# Altium schematic sheet SCH_MCU.SchDoc
size A3; SheetNumber: 2; SheetTotal: 3
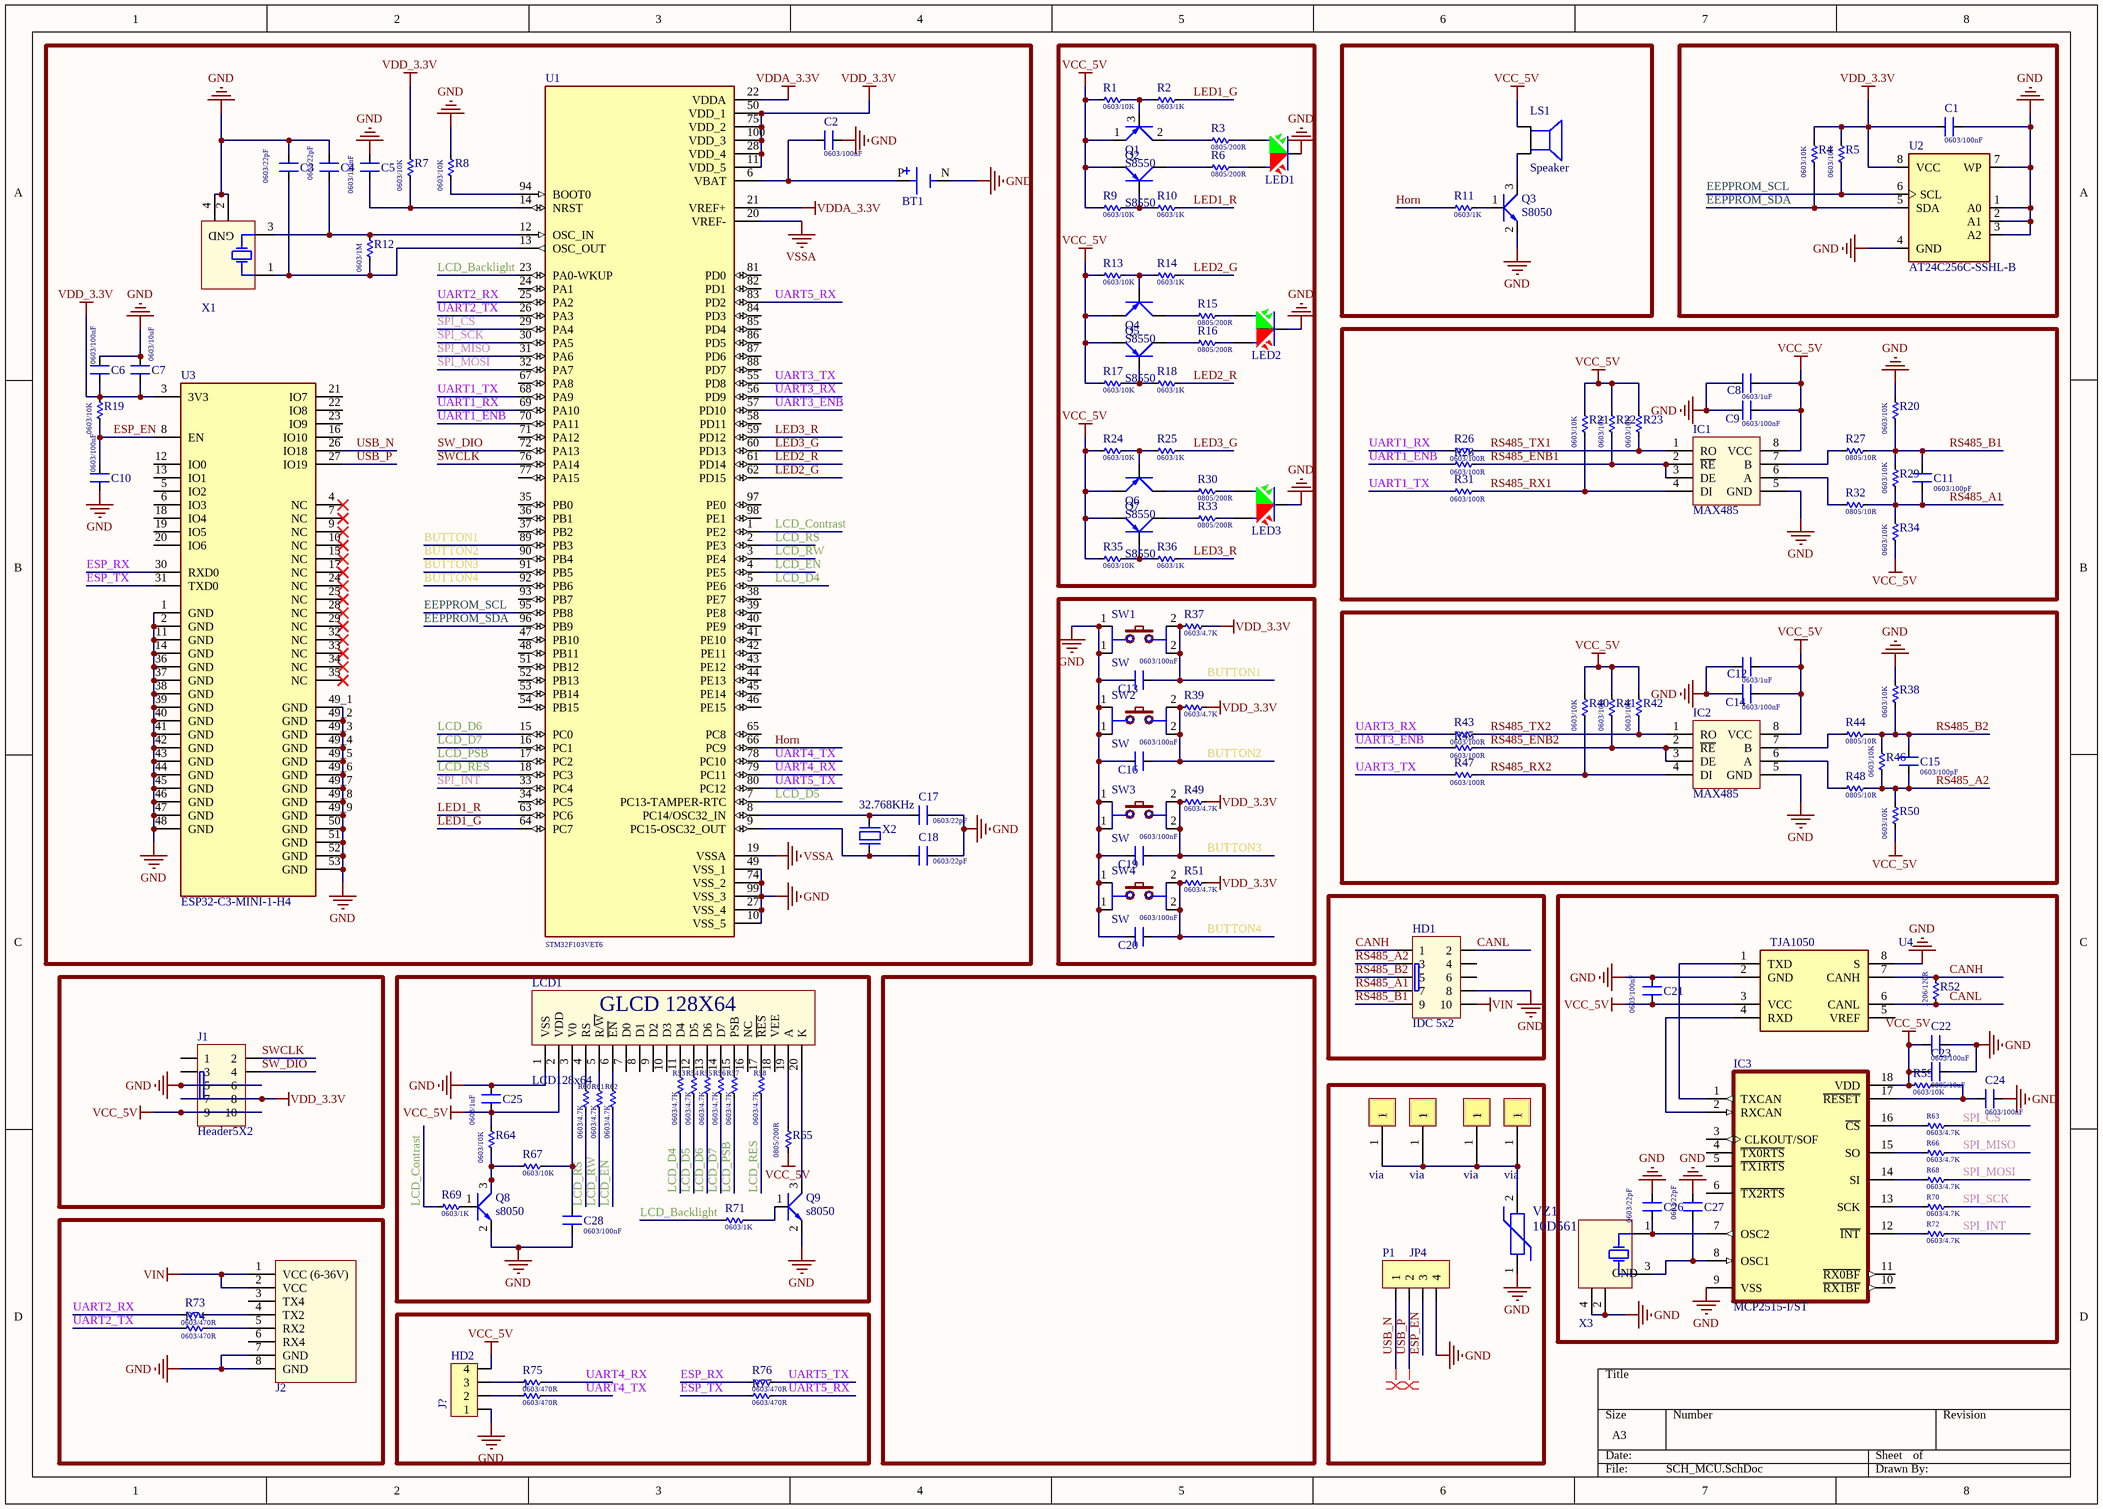
[diagram p0: SCH_MCU.SchDoc]

## Parts
1  0603/470R  [RES-SMD-0603]
BT1  BATTERY  [BAT_CR2032-BS-6-1]  (value not drawn)
C1  0603/100nF  [CAP-SMD-0603]
C2  0603/100nF  [CAP-SMD-0603]
C3  0603/22pF  [CAP-SMD-0603]
C4  0603/22pF  [CAP-SMD-0603]
C5  0603/100nF  [CAP-SMD-0603]
C6  0603/100nF  [CAP-SMD-0603]
C7  0603/10uF  [CAP-SMD-0603]
C8  0603/1uF  [CAP-SMD-0603]
C9  0603/100nF  [CAP-SMD-0603]
C10  0603/100nF  [CAP-SMD-0603]
C11  0603/100pF  [CAP-SMD-0603]
C12  0603/1uF  [CAP-SMD-0603]
C13  0603/100nF  [CAP-SMD-0603]
C14  0603/100nF  [CAP-SMD-0603]
C15  0603/100pF  [CAP-SMD-0603]
C16  0603/100nF  [CAP-SMD-0603]
C17  0603/22pF  [CAP-SMD-0603]
C18  0603/22pF  [CAP-SMD-0603]
C19  0603/100nF  [CAP-SMD-0603]
C20  0603/100nF  [CAP-SMD-0603]
C21  0603/100nF  [CAP-SMD-0603]
C22  0603/100nF  [CAP-SMD-0603]
C23  0805/10uF  [CAP-SMD-0805]
C24  0603/100nF  [CAP-SMD-0603]
C25  0603/1uF  [CAP-SMD-0603]
C26  0603/22pF  [CAP-SMD-0603]
C27  0603/22pF  [CAP-SMD-0603]
C28  0603/100nF  [CAP-SMD-0603]
HD1  IDC 5x2  [IDC10-BH]
HD2  J?  [Header4]
IC1  MAX485  [SO8]
IC2  MAX485  [SO8]
IC3  MCP2515-I/ST  [SO18]
J1  Header5X2  [IDC10-BH]
J2  8pin_2mm  [8PIN_2mm]  (value not drawn)
LCD1  LCD128x64  [LCD128X64 ST7920]
LED1  LED  [LED-32]  (value not drawn)
LED2  LED  [LED-32]  (value not drawn)
LED3  LED  [LED-32]  (value not drawn)
LS1  Speaker  [SPEAKER - 9*5.5]
P1  JP4  [JP4-C1T]
Q1  S8550  [SOT23-321]
Q2  S8550  [SOT23-321]
Q3  S8050  [SOT23-132]
Q4  S8550  [SOT23-321]
Q5  S8550  [SOT23-321]
Q6  S8550  [SOT23-321]
Q7  S8550  [SOT23-321]
Q8  s8050  [SOT23-132]
Q9  s8050  [SOT23-132]
R1  0603/10K  [RES-SMD-0603]
R2  0603/1K  [RES-SMD-0603]
R3  0805/200R  [RES-SMD-0805]
R4  0603/10K  [RES-SMD-0603]
R5  0603/10K  [RES-SMD-0603]
R6  0805/200R  [RES-SMD-0805]
R7  0603/10K  [RES-SMD-0603]
R8  0603/10K  [RES-SMD-0603]
R9  0603/10K  [RES-SMD-0603]
R10  0603/1K  [RES-SMD-0603]
R11  0603/1K  [RES-SMD-0603]
R12  0603/1M  [RES-SMD-0603]
R13  0603/10K  [RES-SMD-0603]
R14  0603/1K  [RES-SMD-0603]
R15  0805/200R  [RES-SMD-0805]
R16  0805/200R  [RES-SMD-0805]
R17  0603/10K  [RES-SMD-0603]
R18  0603/1K  [RES-SMD-0603]
R19  0603/10K  [RES-SMD-0603]
R20  0603/10K  [RES-SMD-0603]
R21  0603/10K  [RES-SMD-0603]
R22  0603/10K  [RES-SMD-0603]
R23  0603/10K  [RES-SMD-0603]
R24  0603/10K  [RES-SMD-0603]
R25  0603/1K  [RES-SMD-0603]
R26  0603/100R  [RES-SMD-0603]
R27  0805/10R  [RES-SMD-0805]
R28  0603/100R  [RES-SMD-0603]
R29  0603/10K  [RES-SMD-0603]
R30  0805/200R  [RES-SMD-0805]
R31  0603/100R  [RES-SMD-0603]
R32  0805/10R  [RES-SMD-0805]
R33  0805/200R  [RES-SMD-0805]
R34  0603/10K  [RES-SMD-0603]
R35  0603/10K  [RES-SMD-0603]
R36  0603/1K  [RES-SMD-0603]
R37  0603/4.7K  [RES-SMD-0603]
R38  0603/10K  [RES-SMD-0603]
R39  0603/4.7K  [RES-SMD-0603]
R40  0603/10K  [RES-SMD-0603]
R41  0603/10K  [RES-SMD-0603]
R42  0603/10K  [RES-SMD-0603]
R43  0603/100R  [RES-SMD-0603]
R44  0805/10R  [RES-SMD-0805]
R45  0603/100R  [RES-SMD-0603]
R46  0603/10K  [RES-SMD-0603]
R47  0603/100R  [RES-SMD-0603]
R48  0805/10R  [RES-SMD-0805]
R49  0603/4.7K  [RES-SMD-0603]
R50  0603/10K  [RES-SMD-0603]
R51  0603/4.7K  [RES-SMD-0603]
R52  1206/120R  [RES-SMD-0603]
R53  0603/4.7K  [RES-SMD-0603]
R54  0603/4.7K  [RES-SMD-0603]
R55  0603/4.7K  [RES-SMD-0603]
R56  0603/4.7K  [RES-SMD-0603]
R57  0603/4.7K  [RES-SMD-0603]
R58  0603/4.7K  [RES-SMD-0603]
R59  0603/10K  [RES-SMD-0603]
R60  0603/4.7K  [RES-SMD-0603]
R61  0603/4.7K  [RES-SMD-0603]
R62  0603/4.7K  [RES-SMD-0603]
R63  0603/4.7K  [RES-SMD-0603]
R64  0603/10K  [RES-SMD-0603]
R65  0805/200R  [RES-SMD-0805]
R66  0603/4.7K  [RES-SMD-0603]
R67  0603/10K  [RES-SMD-0603]
R68  0603/4.7K  [RES-SMD-0603]
R69  0603/1K  [RES-SMD-0603]
R70  0603/4.7K  [RES-SMD-0603]
R71  0603/1K  [RES-SMD-0603]
R72  0603/4.7K  [RES-SMD-0603]
R73  0603/470R  [RES-SMD-0603]
R74  0603/470R  [RES-SMD-0603]
R75  0603/470R  [RES-SMD-0603]
R76  0603/470R  [RES-SMD-0603]
R77  0603/470R  [RES-SMD-0603]
SW1  SW  [BUTTON-12x12]
SW2  SW  [BUTTON-12x12]
SW3  SW  [BUTTON-12x12]
SW4  SW  [BUTTON-12x12]
U1  STM32F103VET6  [QFP50P1600X1600X160-100N]
U2  AT24C256C-SSHL-B  [SO8]
U3  ESP32-C3-MINI-1-H4  [ESP32-C3-MINI-1-H4]
U4  TJA1050  [SO8]
via1  via  [VIA_LO]
via2  via  [VIA_LO]
via3  via  [VIA_LO]
via4  via  [VIA_LO]
VZ1  10D561  [Varistor 7K561 5mm]
X1  16MHz  [XT4-16.000MHz-4_V]  (value not drawn)
X2  32.768KHz  [XT2-32.768KHz-2_V]
X3  8MHz  [XT4-16.000MHz-4_V]  (value not drawn)

## Nets
GND: BT1.N(NEG) C1.1 C2.1 C3.1 C4.1 C5.2 C6.1 C7.1 C8.1 C9.1 C10.2 C12.1 C13.1 C14.1 C16.1 C17.1 C18.1 C19.1 C20.1 C21.1 C22.1 C23.1 C24.1 C25.2 C26.1 C27.1 C28.1 HD1.8 HD2.1 IC1.5(GND) IC2.5(GND) IC3.9(VSS) J1.5 J1.6 J2.7(GND) J2.8(GND) LCD1.1(VSS) LED1.2 LED2.2 LED3.2 P1.4 Q3.2(E) Q8.2(E) Q9.2(E) R8.1 R20.1 R38.1 SW1.1 SW2.1 SW3.1 SW4.1 U1.10(VSS_5) U1.27(VSS_4) U1.49(VSS_1) U1.74(VSS_2) U1.99(VSS_3) U2.1(A0) U2.2(A1) U2.3(A2) U2.4(GND) U2.7(WP) U3.1(GND) U3.2(GND) U3.11(GND) U3.14(GND) U3.36(GND) U3.37(GND) U3.38(GND) U3.39(GND) U3.40(GND) U3.41(GND) U3.42(GND) U3.43(GND) U3.44(GND) U3.45(GND) U3.46(GND) U3.47(GND) U3.48(GND) U3.49_1(GND) U3.49_2(GND) U3.49_3(GND) U3.49_4(GND) U3.49_5(GND) U3.49_6(GND) U3.49_7(GND) U3.49_8(GND) U3.49_9(GND) U3.50(GND) U3.51(GND) U3.52(GND) U3.53(GND) U4.2(GND) U4.8(S) VZ1.1 X1.2(GND) X1.4(GND) X3.2(GND) X3.4(GND)
VCC_5V: C8.2 C9.2 C12.2 C14.2 C21.2 C22.2 C23.2 C25.1 HD2.4 IC1.8(VCC) IC2.8(VCC) IC3.18(VDD) J1.9 J1.10 LCD1.2(VDD) LS1.1 Q1.1(E) Q2.1(E) Q4.1(E) Q5.1(E) Q6.1(E) Q7.1(E) R1.2 R9.2 R13.2 R17.2 R21.1 R22.1 R23.1 R24.2 R34.2 R35.2 R40.1 R41.1 R42.1 R50.2 R59.1 R64.1 R65.1 U4.3(VCC)
VDD_3.3V: C1.2 C6.2 C7.2 J1.7 J1.8 R4.1 R5.1 R7.1 R19.1 R37.2 R39.2 R49.2 R51.2 U1.11(VDD_5) U1.28(VDD_4) U1.50(VDD_1) U1.75(VDD_2) U1.100(VDD_3) U2.8(VCC) U3.3(3V3)
VDDA_3.3V: U1.21(VREF+) U1.22(VDDA)
VIN: HD1.10 J2.1(VCC_(6-36V)) J2.2(VCC)
VSSA: U1.19(VSSA) U1.20(VREF-)
BUTTON1: C13.2 R37.1 SW1.2 U1.89(PB3)
BUTTON2: C16.2 R39.1 SW2.2 U1.90(PB4)
BUTTON3: C19.2 R49.1 SW3.2 U1.91(PB5)
BUTTON4: C20.2 R51.1 SW4.2 U1.92(PB6)
CANH: HD1.1 R52.1 U4.7(CANH)
CANL: HD1.2 R52.2 U4.6(CANL)
EEPPROM_SCL: R5.2 U1.95(PB8) U2.6(SCL)
EEPPROM_SDA: R4.2 U1.96(PB9) U2.5(SDA)
ESP_EN: C10.1 P1.3 R19.2 U3.8(EN)
ESP_RX: R76.1 U3.30(RXD0)
ESP_TX: R77.1 U3.31(TXD0)
Horn: R11.1 U1.66(PC9)
LCD_Backlight: R71.1 U1.23(PA0-WKUP)
LCD_Contrast: R69.1 U1.1(PE2)
LCD_D4: R53.1 U1.5(PE6)
LCD_D5: R54.1 U1.7(PC13-TAMPER-RTC)
LCD_D6: R55.1 U1.15(PC0)
LCD_D7: R56.1 U1.16(PC1)
LCD_EN: R62.1 U1.4(PE5)
LCD_PSB: R57.1 U1.17(PC2)
LCD_RES: R58.1 U1.18(PC3)
LCD_RS: R60.1 U1.2(PE3)
LCD_RW: R61.1 U1.3(PE4)
LED1_G: R2.2 U1.64(PC7)
LED1_R: R10.2 U1.63(PC6)
LED2_G: R14.2 U1.62(PD15)
LED2_R: R18.2 U1.61(PD14)
LED3_G: R25.2 U1.60(PD13)
LED3_R: R36.2 U1.59(PD12)
RS485_A1: C11.1 HD1.7 R29.2 R32.2 R34.1
RS485_A2: C15.1 HD1.3 R46.2 R48.2 R50.1
RS485_B1: C11.2 HD1.9 R20.2 R27.2 R29.1
RS485_B2: C15.2 HD1.5 R38.2 R44.2 R46.1
RS485_ENB1: IC1.2(~{RE}) IC1.3(DE) R22.2 R28.2
RS485_ENB2: IC2.2(~{RE}) IC2.3(DE) R41.2 R45.2
RS485_RX1: IC1.4(DI) R21.2 R31.2
RS485_RX2: IC2.4(DI) R40.2 R47.2
RS485_TX1: IC1.1(RO) R23.2 R26.2
RS485_TX2: IC2.1(RO) R42.2 R43.2
SPI_CS: R63.1 U1.29(PA4)
SPI_INT: R72.1 U1.33(PC4)
SPI_MISO: R66.1 U1.31(PA6)
SPI_MOSI: R68.1 U1.32(PA7)
SPI_SCK: R70.1 U1.30(PA5)
SW_DIO: J1.4 U1.72(PA13)
SWCLK: J1.2 U1.76(PA14)
UART1_ENB: R28.1 U1.70(PA11)
UART1_RX: R26.1 U1.69(PA10)
UART1_TX: R31.1 U1.68(PA9)
UART2_RX: R73.1 U1.25(PA2)
UART2_TX: R74.1 U1.26(PA3)
UART3_ENB: R45.1 U1.57(PD10)
UART3_RX: R43.1 U1.56(PD9)
UART3_TX: R47.1 U1.55(PD8)
UART4_RX: R75.2 U1.79(PC11)
UART4_TX: 1.2 U1.78(PC10)
UART5_RX: R77.2 U1.83(PD2)
UART5_TX: R76.2 U1.80(PC12)
USB_N: P1.1 U3.26(IO18)
USB_P: P1.2 U3.27(IO19)
Net1_1: 1.1 HD2.2
NetBT1_P: BT1.P(POS) C2.2 U1.6(VBAT)
NetC3_2: C3.2 R12.2 U1.13(OSC_OUT) X1.1(XTAL)
NetC4_2: C4.2 R12.1 U1.12(OSC_IN) X1.3(XTAL)
NetC5_1: C5.1 R7.2 U1.14(NRST)
NetC17_2: C17.2 U1.8(PC14/OSC32_IN) X2.2
NetC18_2: C18.2 U1.9(PC15-OSC32_OUT) X2.1
NetC24_2: C24.2 IC3.17(~{RESET}) R59.2
NetC26_2: C26.2 IC3.7(OSC2) X3.1(XTAL)
NetC27_2: C27.2 IC3.8(OSC1) X3.3(XTAL)
NetC28_2: C28.2 LCD1.3(V0) R67.2
NetHD2_3: HD2.3 R75.1
NetIC1_6: IC1.6(A) R32.1
NetIC1_7: IC1.7(B) R27.1
NetIC2_6: IC2.6(A) R48.1
NetIC2_7: IC2.7(B) R44.1
NetIC3_1: IC3.1(TXCAN) U4.1(TXD)
NetIC3_2: IC3.2(RXCAN) U4.4(RXD)
NetIC3_12: IC3.12(~{INT}) R72.2
NetIC3_13: IC3.13(SCK) R70.2
NetIC3_14: IC3.14(SI) R68.2
NetIC3_15: IC3.15(SO) R66.2
NetIC3_16: IC3.16(~{CS}) R63.2
NetJ2_4: J2.4(TX2) R73.2
NetJ2_5: J2.5(RX2) R74.2
NetLCD1_4: LCD1.4(RS) R60.2
NetLCD1_5: LCD1.5(R/~{W}) R61.2
NetLCD1_6: LCD1.6(~{EN}) R62.2
NetLCD1_11: LCD1.11(D4) R53.2
NetLCD1_12: LCD1.12(D5) R54.2
NetLCD1_13: LCD1.13(D6) R55.2
NetLCD1_14: LCD1.14(D7) R56.2
NetLCD1_15: LCD1.15(PSB) R57.2
NetLCD1_17: LCD1.17(~{RES}) R58.2
NetLCD1_19: LCD1.19(A) R65.2
NetLCD1_20: LCD1.20(K) Q9.3(C)
NetLED1_1: LED1.1 R6.2
NetLED1_3: LED1.3 R3.2
NetLED2_1: LED2.1 R16.2
NetLED2_3: LED2.3 R15.2
NetLED3_1: LED3.1 R33.2
NetLED3_3: LED3.3 R30.2
NetLS1_2: LS1.2 Q3.3(C)
NetQ1_2: Q1.2(C) R3.1
NetQ1_3: Q1.3(B) R1.1 R2.1
NetQ2_2: Q2.2(C) R6.1
NetQ2_3: Q2.3(B) R9.1 R10.1
NetQ3_1: Q3.1(B) R11.2
NetQ4_2: Q4.2(C) R15.1
NetQ4_3: Q4.3(B) R13.1 R14.1
NetQ5_2: Q5.2(C) R16.1
NetQ5_3: Q5.3(B) R17.1 R18.1
NetQ6_2: Q6.2(C) R30.1
NetQ6_3: Q6.3(B) R24.1 R25.1
NetQ7_2: Q7.2(C) R33.1
NetQ7_3: Q7.3(B) R35.1 R36.1
NetQ8_1: Q8.1(B) R69.2
NetQ8_3: Q8.3(C) R64.2 R67.1
NetQ9_1: Q9.1(B) R71.2
NetR8_2: R8.2 U1.94(BOOT0)
Netvia1_1: via1.1 via2.1 via3.1 via4.1 VZ1.2

Not connected (* = marked no-connect by the designer): HD1 4 6; IC3 3(CLKOUT/SOF) 4(~{TX0RTS}) 5(~{TX1RTS}) 6(~{TX2RTS}) 10(~{RX1BF}) 11(~{RX0BF}); J1 1 3; J2 3(TX4) 6(RX4); LCD1 7(D0) 8(D1) 9(D2) 10(D3) 16(NC) 18(VEE); U1 24(PA1) 34(PC5) 35(PB0) 36(PB1) 37(PB2) 38(PE7) 39(PE8) 40(PE9) 41(PE10) 42(PE11) 43(PE12) 44(PE13) 45(PE14) 46(PE15) 47(PB10) 48(PB11) 51(PB12) 52(PB13) 53(PB14) 54(PB15) 58(PD11) 65(PC8) 67(PA8) 71(PA12) 77(PA15) 81(PD0) 82(PD1) 84(PD3) 85(PD4) 86(PD5) 87(PD6) 88(PD7) 93(PB7) 97(PE0) 98(PE1); U3 4(NC)* 5(IO2) 6(IO3) 7(NC)* 9(NC)* 10(NC)* 12(IO0) 13(IO1) 15(NC)* 16(IO10) 17(NC)* 18(IO4) 19(IO5) 20(IO6) 21(IO7) 22(IO8) 23(IO9) 24(NC)* 25(NC)* 28(NC)* 29(NC)* 32(NC)* 33(NC)* 34(NC)* 35(NC)*; U4 5(VREF)

## Layout directives
differential pair: USB_N, USB_P

## Notes on the sheet
- (in symbol LCD128x64) GLCD 128X64

## Library data of the parts
1 R1-R77 = Res-SMD: Resistor; Manufacturer: Generic Components; Class: Passive; Published: 08/06/2000; Publisher: Altium Hobart Technology Centre
BT1 = CR2032-BS-6-1: Battery base CR2032 SMD Battery Connectors ROHS; MF: Shenzhen Q&J Electronics Co. Ltd; Package: Package; Check_prices: https://www.snapeda.com/parts/CR2032-BS-6-1/Shenzhen+Q%2526J+Electronics+Co.+Ltd/view-part/?ref=eda; SnapEDA_Link: https://www.snapeda.com/parts/CR2032-BS-6-1/Shenzhen+Q%2526J+Electronics+Co.+Ltd/view-part/?ref=snap; MP: CR2032-BS-6-1; Value: *; Availability: Not in stock; Price: None
C1-C28 = CAP-SMD: Value: 33pF
HD1 = IDC 5X2: Value: Header 5x2
HD2 = Header4: Header IDC, 4 x 1 Pin Vertical 2.54mm Pitch (Non-Boxed, Male); Manufacturer: W¨¹rth Elektronik eiSos GmbH; partNo: 613002143121; ComponentLink1 Description: Manufacturer; ComponentLink2 Description: Datasheet; NoPins: 02; Created Date: 29 March 2013; ComponentLink1URL: http://www.we-online.com; ComponentLink2URL: http://katalog.we-online.de/em/datasheet/6130xx143121.pdf; Created by: Karrer Zheng
IC1 IC2 = IC MAX485: RS232 - RS485 (Same sn75176)
IC3 = MCP2515-I/ST: CAN 1Mbps Sleep/Standby 3.3V/5V 20-Pin TSSOP Tube; MF: Microchip Technology; Package: TSSOP-20 Microchip; MP: MCP2515-I/ST; Value: *; Availability: In Stock; SnapEDA_Link: https://www.snapeda.com/parts/MCP2515-I/ST/Microchip/view-part/?ref=snap; Price: None; Check_prices: https://www.snapeda.com/parts/MCP2515-I/ST/Microchip/view-part/?ref=eda
LCD1 = LCD128x64: LCD Graphic 128x64; Value: LCD 128x64
LED1-LED3 = LED2: LED 2 colour Green and Red; Value: LED 3 - 5 ly 2 Colour
LS1 = Speaker: Loudspeaker; Published: 24-Mar-1999; LatestRevisionDate: 17-Jul-2002; LatestRevisionNote: Re-released for DXP Platform.; PackageReference: PIN2; Publisher: Altium Limited
P1 = JP4: WR-PHD 2.54 mm Angled Socket Header; Manufacturer: W¨¹rth Elektronik eiSos GmbH; partNo: 613004143121; ComponentLink1 Description: Manufacturer; ComponentLink2 Description: Datasheet; NoPins: 04; Created Date: 29 March 2013; ComponentLink1URL: http://www.we-online.com; ComponentLink2URL: http://katalog.we-online.de/em/datasheet/6130xx143121.pdf; Created by: Karrer Zheng
Q1 Q2 Q4-Q7 = BJT PNP: PNP 600mW, ECB; Value: A1015
Q3 Q8 Q9 = BJT NPN: NPN 600mW, ECB; Value: C1815
SW1-SW4 = SW4: Switch button 4 pin; Value: Button chip 4 pin
U1 = STM32F103VET6: ARMÂ® CortexÂ®-M3 STM32F1 Microcontroller IC 32-Bit 72MHz 512KB (512K x 8) FLASH 100-LQFP (14x14); MF: STMicroelectronics; SnapEDA_Link: https://www.snapeda.com/parts/STM32F103VET6/STMicroelectronics/view-part/?ref=snap; Package: LQFP-100 STMicroelectronics; Value: *; MP: STM32F103VET6; Check_prices: https://www.snapeda.com/parts/STM32F103VET6/STMicroelectronics/view-part/?ref=eda
U2 = AT24C256C-SSHL-B: EEPROM Serial-2Wire 256K-bit 32K x 8 1.8V/2.5V/3.3V/5V Automotive 8-Pin SOIC N Tube; MF: Microchip Technology; Package: SO-8 Microchip; Price: None; Check_prices: https://www.snapeda.com/parts/AT24C256C-SSHL-B/Microchip/view-part/?ref=eda; Value: *; SnapEDA_Link: https://www.snapeda.com/parts/AT24C256C-SSHL-B/Microchip/view-part/?ref=snap; MP: AT24C256C-SSHL-B; Availability: In Stock; Purchase-URL: https://pricing.snapeda.com/search/part/AT24C256C-SSHL-B/?ref=eda
U3 = ESP32-C3-MINI-1-H4: Bluetooth, WiFi 802.11b/g/n, Bluetooth v5.0 Transceiver Module 2.412GHz ~ 2.484GHz PCB Trace Surface Mount; Price: None; Value: *
U4 = TJA1050: CAN 1MBd Silent 5V Automotive 8-Pin SO T/R; MF: NXP Semiconductors; SnapEDA_Link: https://www.snapeda.com/parts/TJA1050/NXP+Semiconductors/view-part/?ref=snap; Package: None; Value: *; MP: TJA1050; Check_prices: https://www.snapeda.com/parts/TJA1050/NXP+Semiconductors/view-part/?ref=eda
via1-via4 = Vit oc
VZ1 = VAR: Varistor; Published: 24-Mar-1999; LatestRevisionDate: 04-Mar-2005; LatestRevisionNote: PCB Footprint replaced.; PackageReference: 6-0805; Publisher: Altium Limited
X1 X3 = XT4: Crystal, 16 MHz, -30 to 85 degC, 3.2 x 2.5 x 0.9 mm SMD; Value: 4Mhz
X2 = XT2: Crystal, 32.768 KHz, -40 to 85 degC, 3.2 x 1.5 x 0.9 mm SMD; Value: 4Mhz
J1 = Header5X2: Value: Header 5x2